# Altium schematic sheet CDA.SchDoc
size A
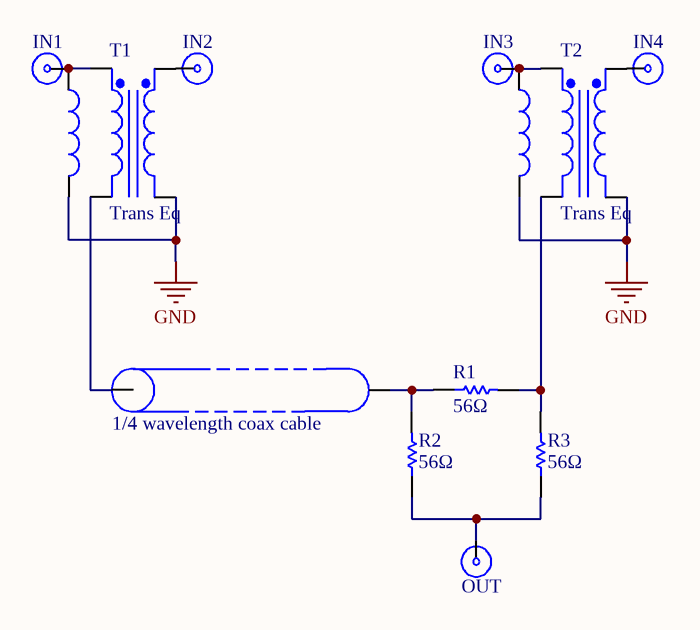
[diagram p0: CDA.SchDoc]

## Parts
(Parts that share a designator on the sheet are numbered #1, #2 ... from top to bottom, then left to right.)
C?  1/4 wavelength coax cable
IN1  connector  (value not drawn)
IN2  connector  (value not drawn)
IN3  connector  (value not drawn)
IN4  connector  (value not drawn)
L?#1  Inductor  [0402-A]  (value not drawn)
L?#2  Inductor  [0402-A]  (value not drawn)
OUT  connector  (value not drawn)
R1  56Ω  [AXIAL-0.3]
R2  56Ω  [AXIAL-0.3]
R3  56Ω  [AXIAL-0.3]
T1  Trans Eq  [TRF_4]
T2  Trans Eq  [TRF_4]

## Nets
GND: L?#1.2 L?#2.2 T1.4(Sec-) T2.4(Sec-)
NetC?_5: C?.5 T1.2(Pri-)
NetC?_6: C?.6 R1.1 R2.2
NetIN1_7: IN1.7 L?#1.1 T1.1(Pri+)
NetIN2_7: IN2.7 T1.3(Sec+)
NetIN3_7: IN3.7 L?#2.1 T2.1(Pri+)
NetIN4_7: IN4.7 T2.3(Sec+)
NetOUT_7: OUT.7 R2.1 R3.1
NetR1_2: R1.2 R3.2 T2.2(Pri-)

## Library data of the parts
C? = coax
L?#1 L?#2 = Inductor: Code_IEC: 1005; Value: 10mH; Published: 8-Jun-2000; LatestRevisionDate: 29-May-2009; LatestRevisionNote: IPC-7351 Footprint Added.; PackageReference: 0402-A; Publisher: Altium Limited; PackageDescription: Chip Inductor; Code_JEITA: 0402
R1 = Res1: Resistor; 56: 1K; Published: 8-Jun-2000; LatestRevisionDate: 17-Jul-2002; LatestRevisionNote: Re-released for DXP Platform.; PackageReference: AXIAL-0.3; Publisher: Altium Limited; PackageDescription: Axial Device, Thru-Hole; 2 Leads; 0.3 in Pin Spacing
R2 R3 = Res1: Resistor; Value: 1K; Published: 8-Jun-2000; LatestRevisionDate: 17-Jul-2002; LatestRevisionNote: Re-released for DXP Platform.; PackageReference: AXIAL-0.3; Publisher: Altium Limited; PackageDescription: Axial Device, Thru-Hole; 2 Leads; 0.3 in Pin Spacing
T1 T2 = Trans Eq: Transformer (Equivalent Circuit Model); Published: 8-Jun-2000; LatestRevisionDate: 17-Jul-2002; LatestRevisionNote: Re-released for DXP Platform.; PackageReference: TRF_4; Publisher: Altium Limited; PackageDescription: Transformer; 4 Leads